# EAGLE schematic FLEX_DCDC (EAGLE 9.5.2)
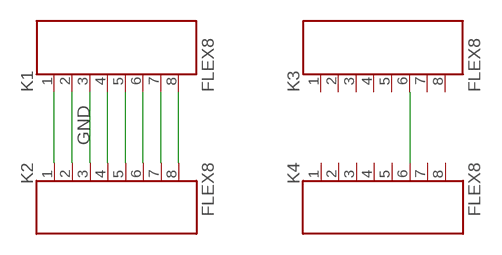
[diagram p0: schematic, sheet 1]

## Parts
K1  FLEX8  [FLEX8]
K2  FLEX8  [FLEX8]
K3  FLEX8  [FLEX8]
K4  FLEX8  [FLEX8]

## Nets
GND: K1.3 K2.3 K3.6 K4.6
N$1: K1.1 K2.1
N$2: K1.2 K2.2
N$4: K1.4 K2.4
N$5: K1.5 K2.5
N$6: K1.6 K2.6
N$7: K1.7 K2.7
N$8: K1.8 K2.8
Unconnected: K3.1 K3.2 K3.3 K3.4 K3.5 K3.7 K3.8 K4.1 K4.2 K4.3 K4.4 K4.5 K4.7 K4.8

## Library data of the parts
K1-K4 = Flex:FLEX8: WR-FPC 1mm SMT Horiz. Bot. Contact Hinge type WR-FPC 1mm 08 pins Hinge type SMT Horizontal Bottom Contact ;=>Code : Con_FPC_ZIF_1.00_6861xx148922_686108148922 <http://katalog.we-online.de/media/images/eican/Con_FPC_ZIF_1.00_686110148922_pf2.jpg> Details see: http://katalog.we-online.de/em/datasheet/6861xx148922.pdf Created 2014-10-08, Karrer Zheng 2014 (C) Wurth Elektronik